# Altium schematic sheet Steering Wheel Interface Schmitt Inverters.SchDoc: Steering Wheel Interface - Schmitt Inverters
size Tabloid; Organization: Midnight Sun Solar Rayce Car Team; Address1: University of Waterloo; Address2: 200 University Ave W; Address3: Waterloo, ON, Canada; Address4: N2L 3E9; DocumentNumber: 3; SheetNumber: 5; SheetTotal: 5; Website: www.uwmidsun.com; ProjectName: ProjectName
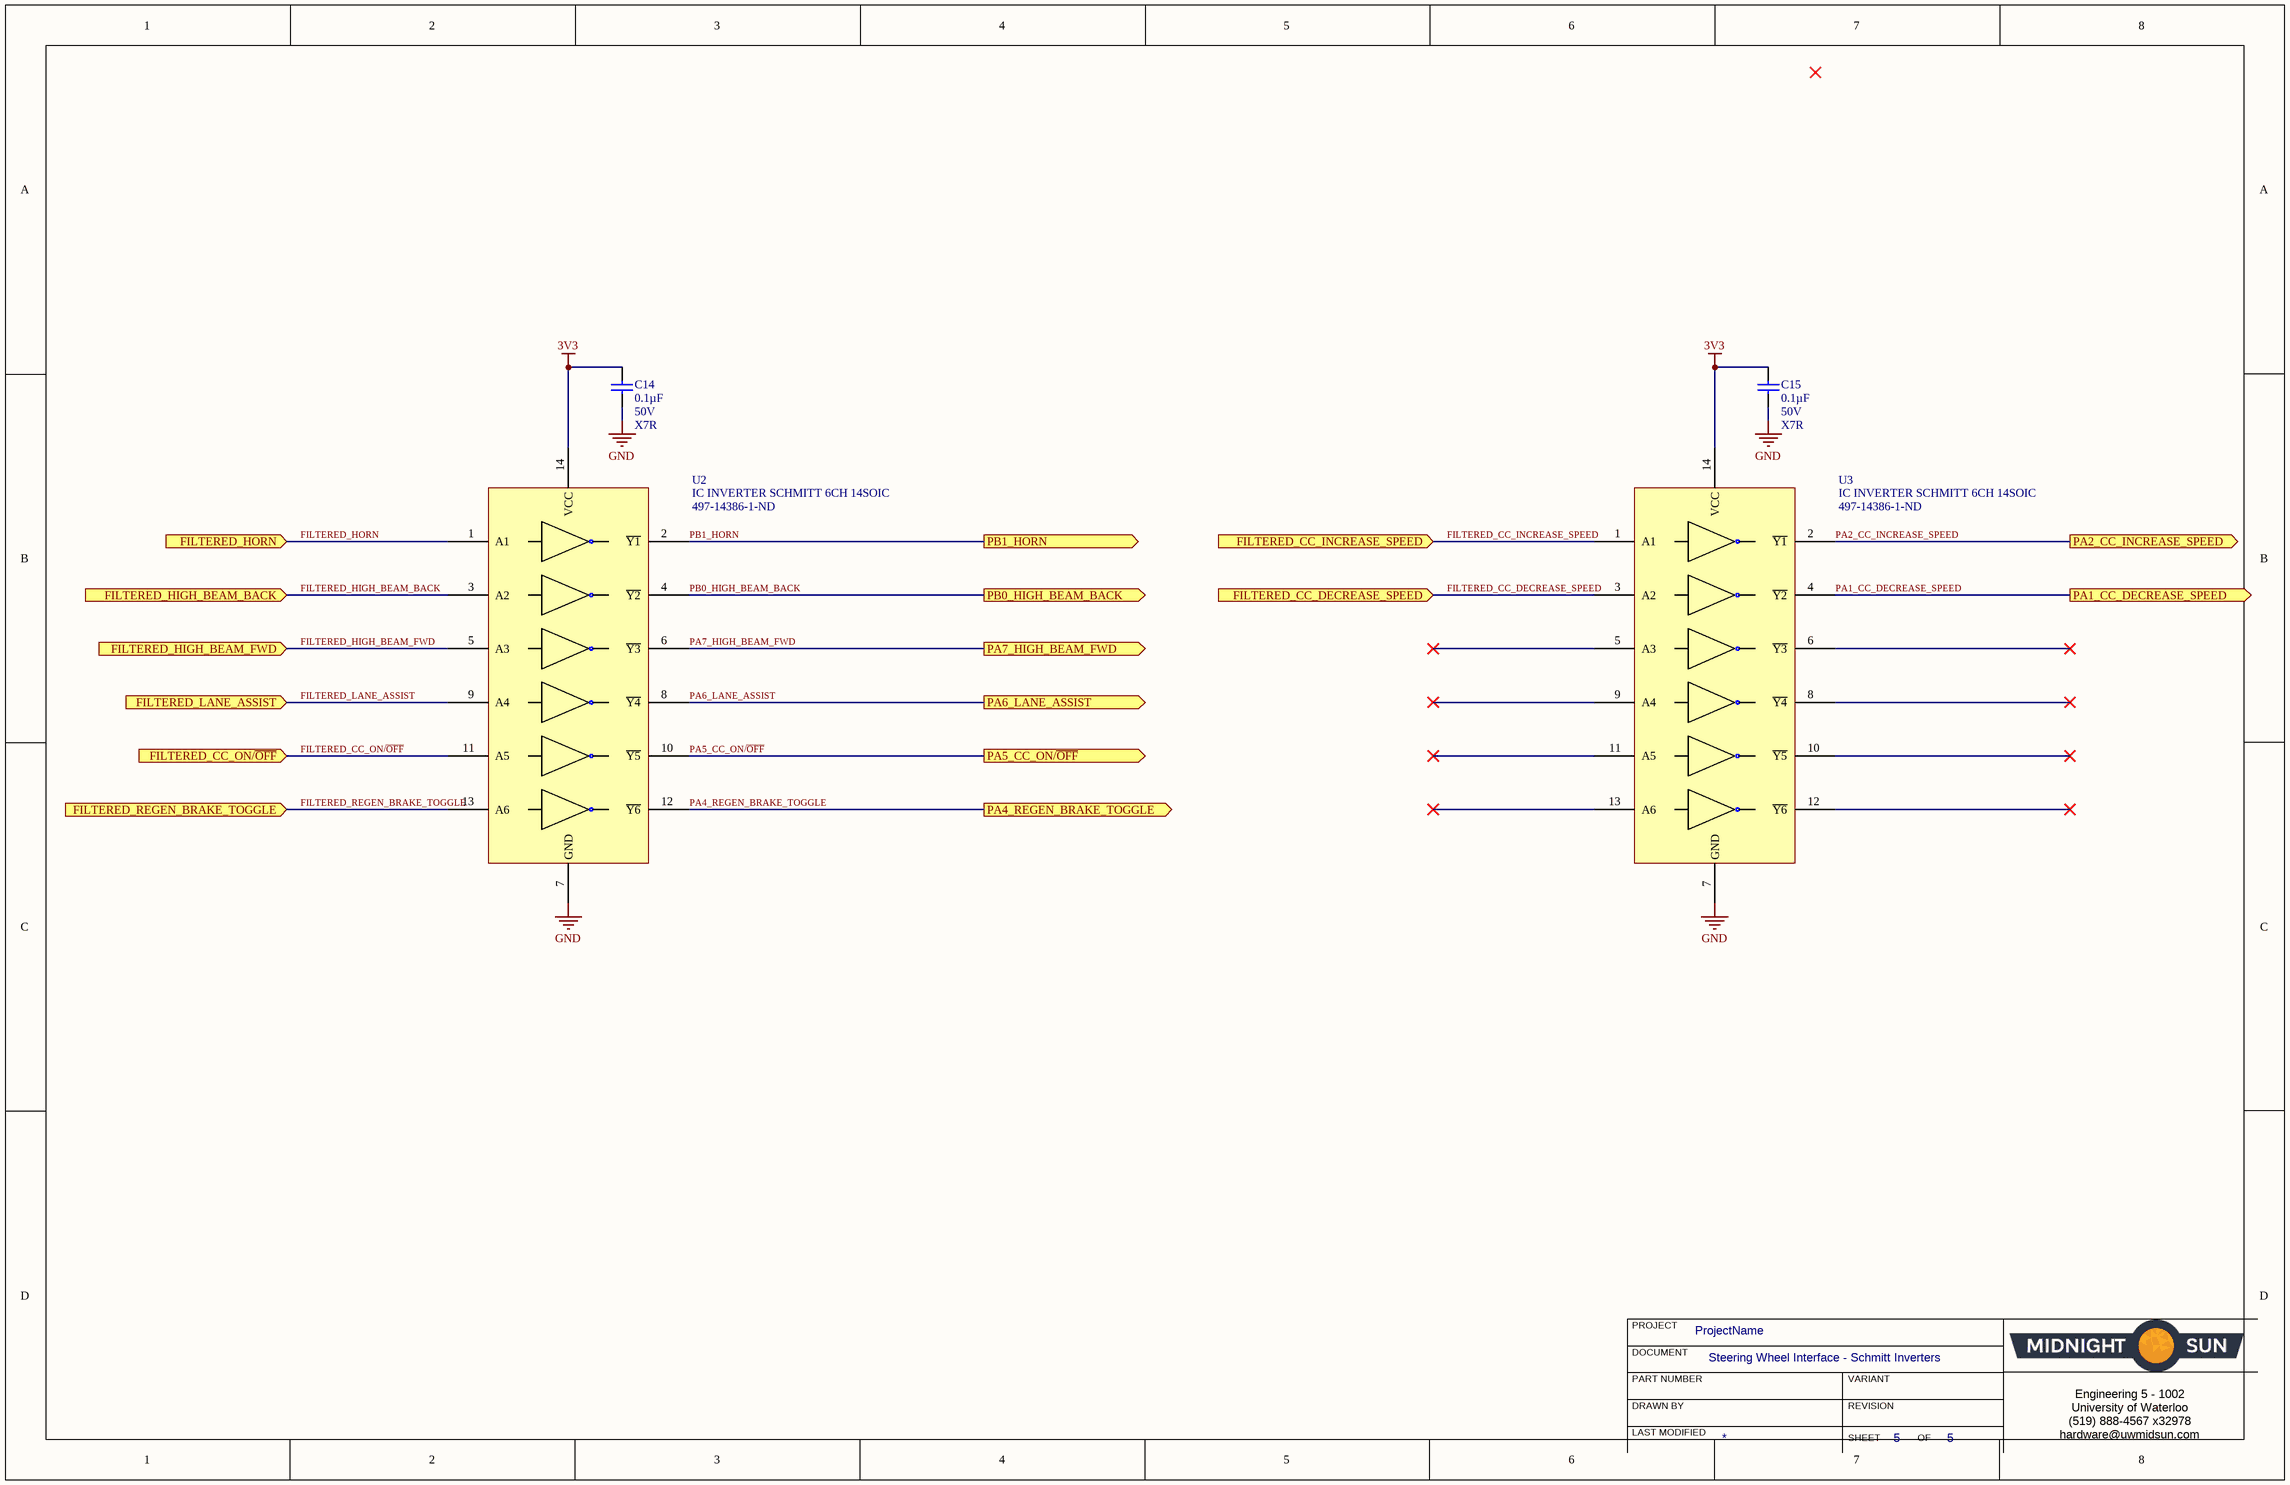
[diagram p0: Steering Wheel Interface Schmitt Inverters.SchDoc]

## Parts
C14  Capacitance: 0.1µF  Voltage: 50V  Temperature Coefficient: X7R  [CAP, 0603]  (hidden comment: CAP CER 0.1UF 50V 10% X7R 0603)
C15  Capacitance: 0.1µF  Voltage: 50V  Temperature Coefficient: X7R  [CAP, 0603]  (hidden comment: CAP CER 0.1UF 50V 10% X7R 0603)
U2  IC INVERTER SCHMITT 6CH 14SOIC  Supplier Part Number 1: 497-14386-1-ND  [IC INVERTER SCHMITT 6CH 14TSSOP]
U3  IC INVERTER SCHMITT 6CH 14SOIC  Supplier Part Number 1: 497-14386-1-ND  [IC INVERTER SCHMITT 6CH 14TSSOP]

## Ports
FILTERED_CC_DECREASE_SPEED (in), FILTERED_CC_INCREASE_SPEED (in), FILTERED_CC_ON/~{OFF} (in), FILTERED_HIGH_BEAM_BACK (in), FILTERED_HIGH_BEAM_FWD (in), FILTERED_HORN (in), FILTERED_LANE_ASSIST (in), FILTERED_REGEN_BRAKE_TOGGLE (in), PA1_CC_DECREASE_SPEED (out), PA2_CC_INCREASE_SPEED (out), PA4_REGEN_BRAKE_TOGGLE (out), PA5_CC_ON/~{OFF} (out), PA6_LANE_ASSIST (out), PA7_HIGH_BEAM_FWD (out), PB0_HIGH_BEAM_BACK (out), PB1_HORN (out)

## Nets
3V3: C14.1 C15.1 U2.14(VCC) U3.14(VCC)
GND: C14.2 C15.2 U2.7(GND) U3.7(GND)
FILTERED_CC_DECREASE_SPEED: U3.3(A2) ; port FILTERED_CC_DECREASE_SPEED
FILTERED_CC_INCREASE_SPEED: U3.1(A1) ; port FILTERED_CC_INCREASE_SPEED
FILTERED_CC_ON/~{OFF}: U2.11(A5) ; port FILTERED_CC_ON/~{OFF}
FILTERED_HIGH_BEAM_BACK: U2.3(A2) ; port FILTERED_HIGH_BEAM_BACK
FILTERED_HIGH_BEAM_FWD: U2.5(A3) ; port FILTERED_HIGH_BEAM_FWD
FILTERED_HORN: U2.1(A1) ; port FILTERED_HORN
FILTERED_LANE_ASSIST: U2.9(A4) ; port FILTERED_LANE_ASSIST
FILTERED_REGEN_BRAKE_TOGGLE: U2.13(A6) ; port FILTERED_REGEN_BRAKE_TOGGLE
PA1_CC_DECREASE_SPEED: U3.4(~{Y2}) ; port PA1_CC_DECREASE_SPEED
PA2_CC_INCREASE_SPEED: U3.2(~{Y1}) ; port PA2_CC_INCREASE_SPEED
PA4_REGEN_BRAKE_TOGGLE: U2.12(~{Y6}) ; port PA4_REGEN_BRAKE_TOGGLE
PA5_CC_ON/~{OFF}: U2.10(~{Y5}) ; port PA5_CC_ON/~{OFF}
PA6_LANE_ASSIST: U2.8(~{Y4}) ; port PA6_LANE_ASSIST
PA7_HIGH_BEAM_FWD: U2.6(~{Y3}) ; port PA7_HIGH_BEAM_FWD
PB0_HIGH_BEAM_BACK: U2.4(~{Y2}) ; port PB0_HIGH_BEAM_BACK
PB1_HORN: U2.2(~{Y1}) ; port PB1_HORN

Not connected (* = marked no-connect by the designer): U3 5(A3)* 6(~{Y3})* 8(~{Y4})* 9(A4)* 10(~{Y5})* 11(A5)* 12(~{Y6})* 13(A6)*

## Notes on the sheet
- PROJECT
- DOCUMENT
- PART NUMBER
- DRAWN BY
- LAST MODIFIED
- VARIANT
- REVISION
- SHEET
- OF
- Engineering 5 - 1002
  University of Waterloo
  (519) 888-4567 x32978
  hardware@uwmidsun.com
- Title
- Size:
- Date:
- Tabloid
- Number:
- Time:
- Revision:
- Sheet
- of
- File:

## Library data of the parts
C14 C15 = CAP CER 0.1UF 50V 10% X7R 0603: 0.10µF ±10% 50V Ceramic Capacitor X7R 0603 (1608 Metric); Manufacturer 1: AVX Corporation; Manufacturer Part Number 1: 06035C104KAT2A; Supplier 1: Digi-Key; Supplier Part Number 1: 478-5052-1-ND; Packaging: Cut Tape (CT); Part Status: Active; Operating Temperature: -55°C ~ 125°C; Ratings: -; Mounting Type: Surface Mount, MLCC; Package / Case: 0603 (1608 Metric); Size / Dimension: 0.063" L x 0.032" W (1.60mm x 0.81mm); Height - Seated (Max): -; Thickness (Max): 0.035" (0.90mm); Lead Spacing: -; Lead Style: -; ComponentLink1URL: http://datasheets.avx.com/X7RDielectric.pdf; ComponentLink1Description: http://datasheets.avx.com/X7RDielectric.pdf; Tolerance: ±10%
U2 U3 = IC INVERTER SCHMITT 6CH 14TSSOP: Inverter IC 6 Channel Schmitt Trigger 14-SOIC; Manufacturer: STMicroelectronics; Manufacturer Part Number: M74HC14YRM13TR; Number of Inputs: 6; Propagation Delay: 21ns; Max Supply Voltage: 6V; Min Supply Voltage: 2V; Quiescent Current: 1uA; High Level Output Current: -5.2mA; Low Level Output Current: 5.2mA; Turn-On Delay Time: 190ns; ComponentLink1Description: Digikey; ComponentLink1URL: https://www.digikey.ca/product-detail/en/stmicroelectronics/M74HC14YTTR/497-14387-1-ND/4725844; Supplier 1: Digi-Key; RoHS: Yes; Stock 1: 28888; Pricing 1: 1 = 0.48000, 10 = 0.41300, 100 = 0.30860, 500 = 0.24246, 1000 = 0.18736 (USD); Mount: Surface Mount; Case/Package: SO; Number of Pins: 14; Weight: 0.009143oz; Min Operating Temperature: -40°C; Max Operating Temperature: 125°C; Packaging: Tape and Reel; Package Quantity: 2500; Logic Function: Inverter; Number of Circuits: 6; ComponentLink2URL: http://www.st.com/content/ccc/resource/technical/document/datasheet/19/a3/52/42/dd/ab/4b/46/CD00000263.pdf/files/CD00000263.pdf/jcr:content/translations/en.CD00000263.pdf; ComponentLink2Description: http://www.st.com/content/ccc/resource/technical/document/datasheet/19/a3/52/42/dd/ab/4b/46/CD00000263.pdf/files/CD00000263.pdf/jcr:content/translations/en.CD00000263.pdf; ComponentLink3URL: http://www.st.com/st-web-ui/static/active/en/resource/technical/document/datasheet/CD00000263.pdf; ComponentLink3Description: http://www.st.com/st-web-ui/static/active/en/resource/technical/document/datasheet/CD00000263.pdf; ComponentLink4Description: http://www.st.com/content/ccc/resource/technical/document/datasheet/19/a3/52/42/dd/ab/4b/46/CD00000263.pdf/files/CD00000263.pdf/jcr:content/translations/en.CD00000263.pdf?src-supplier=Digi-Key; ComponentLink4URL: http://www.st.com/content/ccc/resource/technical/document/datasheet/19/a3/52/42/dd/ab/4b/46/CD00000263.pdf/files/CD00000263.pdf/jcr:content/translations/en.CD00000263.pdf?src-supplier=Digi-Key; ComponentLink5Description: http://www.st.com/st-web-ui/static/active/en/resource/technical/document/datasheet/CD00000263.pdf?src-supplier=Avnet; ComponentLink5URL: http://www.st.com/st-web-ui/static/active/en/resource/technical/document/datasheet/CD00000263.pdf?src-supplier=Avnet; Number of Elements: 6